# EAGLE design arduino_shield_schematic (EAGLE 9.6.2)
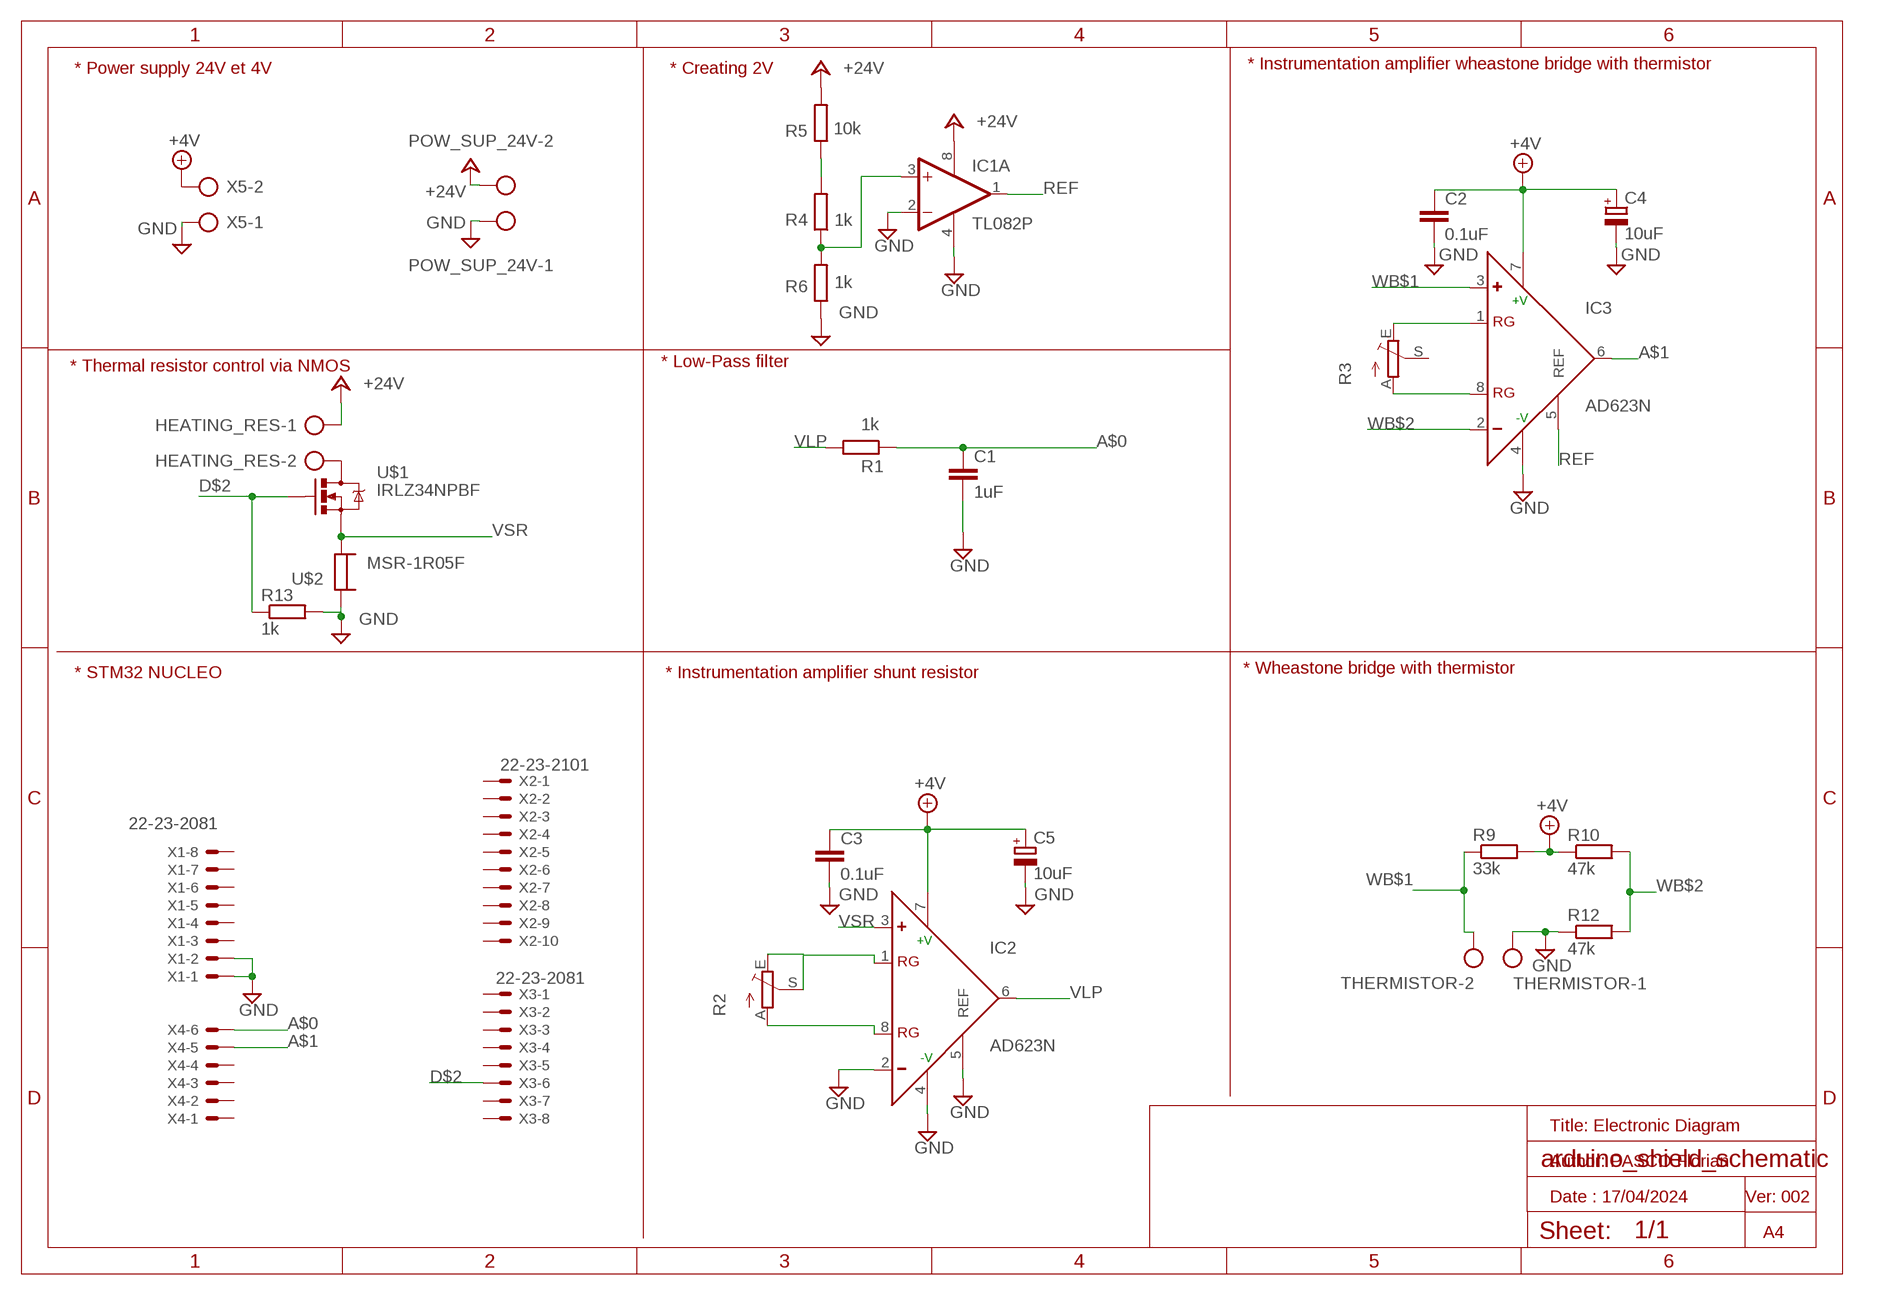
[diagram p0: schematic, sheet 1]

## Parts
C1  1uF  C-EU025-025X050  [C025-025X050]
C2  0.1uF  C-EU025-025X050  [C025-025X050]
C3  0.1uF  C-EU025-025X050  [C025-025X050]
C4  10uF  CPOL-EUE2,5-6E  [E2,5-6E]
C5  10uF  CPOL-EUE2,5-6E  [E2,5-6E]
HEATING_RES  AK300/2  [AK300/2]
IC1  TL082P  [DIL08]
IC2  AD623N  [DIL08]
IC3  AD623N  [DIL08]
POW_SUP_24V  AK300/2  [AK300/2]
R1  1k  R-EU_0207/10  [0207/10]
R2  TRIM_EU-S64W  [S64W]
R3  TRIM_EU-S64W  [S64W]
R4  1k  R-EU_0207/10  [0207/10]
R5  10k  R-EU_0207/10  [0207/10]
R6  1k  R-EU_0207/10  [0207/10]
R9  33k  R-EU_0207/10  [0207/10]
R10  47k  R-EU_0207/10  [0207/10]
R12  47k  R-EU_0207/10  [0207/10]
R13  1k  R-EU_0207/10  [0207/10]
THERMISTOR  AK300/2  [AK300/2]
U$1  IRLZ34NPBF  [TO-220(2)]
U$2  MSR-1R05F  [MSR1]
X1  22-23-2081  [22-23-2081]
X2  22-23-2101  [22-23-2101]
X3  22-23-2081  [22-23-2081]
X4  22-23-2061  [22-23-2061]
X5  AK300/2  [AK300/2]

## Nets
+4.1V: C2.1 C3.1 C4.+ C5.+ IC2.7(+V) IC3.7(+V) R9.2 R10.1 X5.2 ; supply symbol labelled +4V
+24V: HEATING_RES.1 IC1.8(P:V+) POW_SUP_24V.2 R5.2
A$0: C1.1 R1.1 X4.6
A$1: IC3.6(OUT) X4.5
D$2: R13.1 U$1.IN(G) X3.6
GND: C1.2 C2.2 C3.2 C4.- C5.- IC1.2(A:-IN) IC1.4(P:V-) IC2.2(-) IC2.4(-V) IC2.5(REF) IC3.4(-V) POW_SUP_24V.1 R6.1 R12.1 R13.2 THERMISTOR.1 U$2.P$2 X1.1 X1.2 X5.1
N$1: R2.E R2.S
N$2: IC2.1(RG)
N$3: R4.2 R5.1
N$4: IC1.3(A:+IN) R4.1 R6.2
N$5: IC2.8(RG) R2.A
N$6: IC3.1(RG) R3.E
N$7: IC3.8(RG) R3.A
N$10: HEATING_RES.2 U$1.GND(D)
REF: IC1.1(A:OUT) IC3.5(REF)
VLP: IC2.6(OUT) R1.2
VSR: IC2.3(+) U$1.OUT(S) U$2.P$1
WB$1: IC3.3(+) R9.1 THERMISTOR.2
WB$2: IC3.2(-) R10.2 R12.2
Unconnected: IC1.5(B:+IN) IC1.6(B:-IN) IC1.7(B:OUT) R3.S X1.3 X1.4 X1.5 X1.6 X1.7 X1.8 X2.1 X2.2 X2.3 X2.4 X2.5 X2.6 X2.7 X2.8 X2.9 X2.10 X3.1 X3.2 X3.3 X3.4 X3.5 X3.7 X3.8 X4.1 X4.2 X4.3 X4.4

## Notes on the sheet
- * Power supply 24V et 4V | * Creating 2V | * Instrumentation amplifier wheastone bridge with thermistor
- * Thermal resistor control via NMOS | * Low-Pass filter
- * STM32 NUCLEO | * Instrumentation amplifier shunt resistor | * Wheastone bridge with thermistor
- Title: Electronic Diagram
- Author: PASCO Florian
- Date : 17/04/2024 | Ver: 002
- A4

## Library data of the parts
C1-C3 = rcl:C-EU: CAPACITOR, European symbol; SPICEPREFIX: C
C4 C5 = rcl:CPOL-EU: POLARIZED CAPACITOR, European symbol; SPICEPREFIX: C
HEATING_RES POW_SUP_24V THERMISTOR X5 = con-ptr500:AK300/2: CONNECTOR; OC_FARNELL: unknown; OC_NEWARK: unknown
IC1 = linear:TL082: OP AMP Data sheet <http://www.ti.com/lit/ds/symlink/tl084a . pdf>; DATA_SHEET: <a href="http://www.ti.com/lit/ds/symlink/tl084a.pdf"> Data sheet </a>
IC2 IC3 = analog-devices:AD623: Single-Supply, Rail-to-Rail, Low Cost Instrumentation Amplifier Source: http://www.analog.com/static/imported-files/data_sheets/AD623.pdf; MF: ALTERA CORPORATION; MPN: AD623ANZ; OC_FARNELL: 9603700; OC_NEWARK: 59K4402
R1 R4-R6 R9 R10 R12 R13 = rcl:R-EU_: RESISTOR, European symbol; SPICEPREFIX: R
R2 R3 = pot:TRIM_EU-: POTENTIOMETER
U$1 = IRLZ34NPBF:IRLZ34NPBF: Check availability <https://pricing.snapeda.com/parts/IRLZ34NPBF/Infineon/view-part?ref=eda>; AVAILABILITY: In Stock; CHECK_PRICES: https://www.snapeda.com/parts/IRLZ34NPBF/Infineon+Technologies/view-part/?ref=eda; DESCRIPTION: MOSFET, Power,N-Ch,VDSS 55V,RDS(ON) 0.035Ohm,ID 30A,TO-220AB,PD 68W,VGS +/-16V | Infineon IRLZ34NPBF; MF: Infineon; MP: IRLZ34NPBF; PACKAGE: TO-220 Infineon; PRICE: None; PURCHASE-URL: https://www.snapeda.com/api/url_track_click_mouser/?unipart_id=219&manufacturer=Infineon&part_name=IRLZ34NPBF&search_term=None; SNAPEDA_LINK: https://www.snapeda.com/parts/IRLZ34NPBF/Infineon+Technologies/view-part/?ref=snap
U$2 = MSR-1R05F:MSR-1R05F
X1 X3 = con-molex:22-23-2081: .100" (2.54mm) Center Header - 8 Pin; MF: MOLEX; MPN: 22-23-2081; OC_FARNELL: 1756826; OC_NEWARK: 01C7592
X2 = con-molex:22-23-2101: .100" (2.54mm) Center Header - 10 Pin; MF: MOLEX; MPN: 22-23-2101; OC_FARNELL: 1756828; OC_NEWARK: 94C0765
X4 = con-molex:22-23-2061: .100" (2.54mm) Center Header - 6 Pin; MF: MOLEX; MPN: 22-23-2061; OC_FARNELL: 1462922; OC_NEWARK: 27C1933

## Board
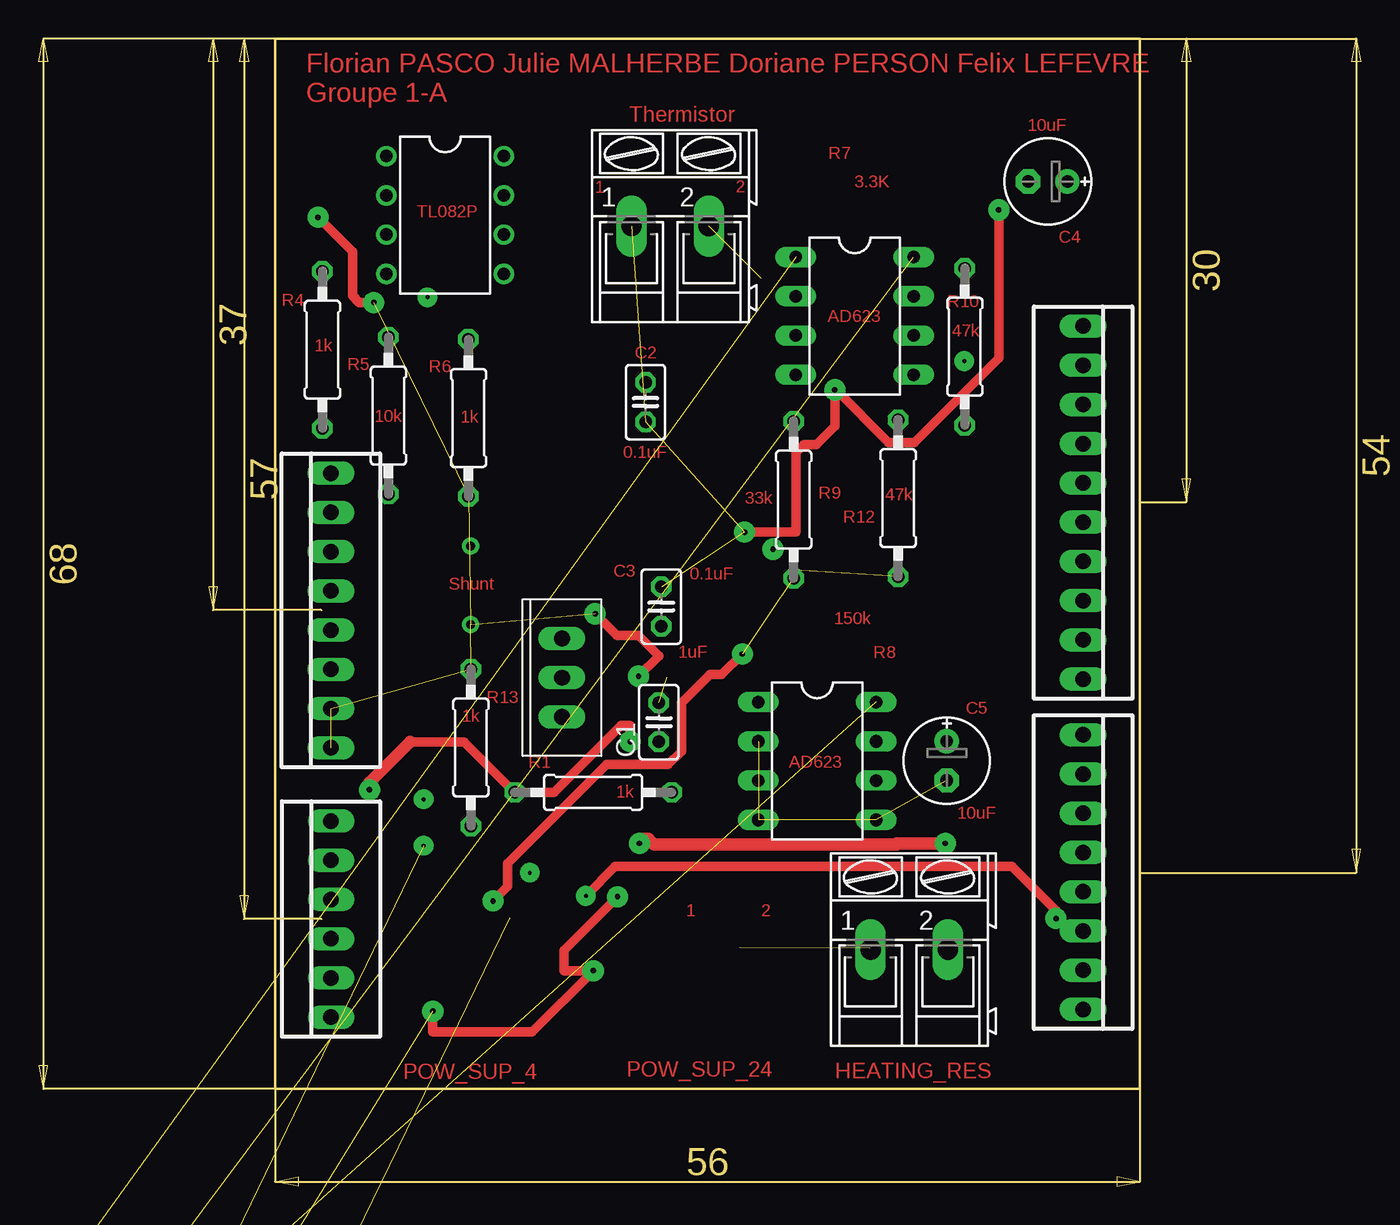
[diagram p1: board, top side]
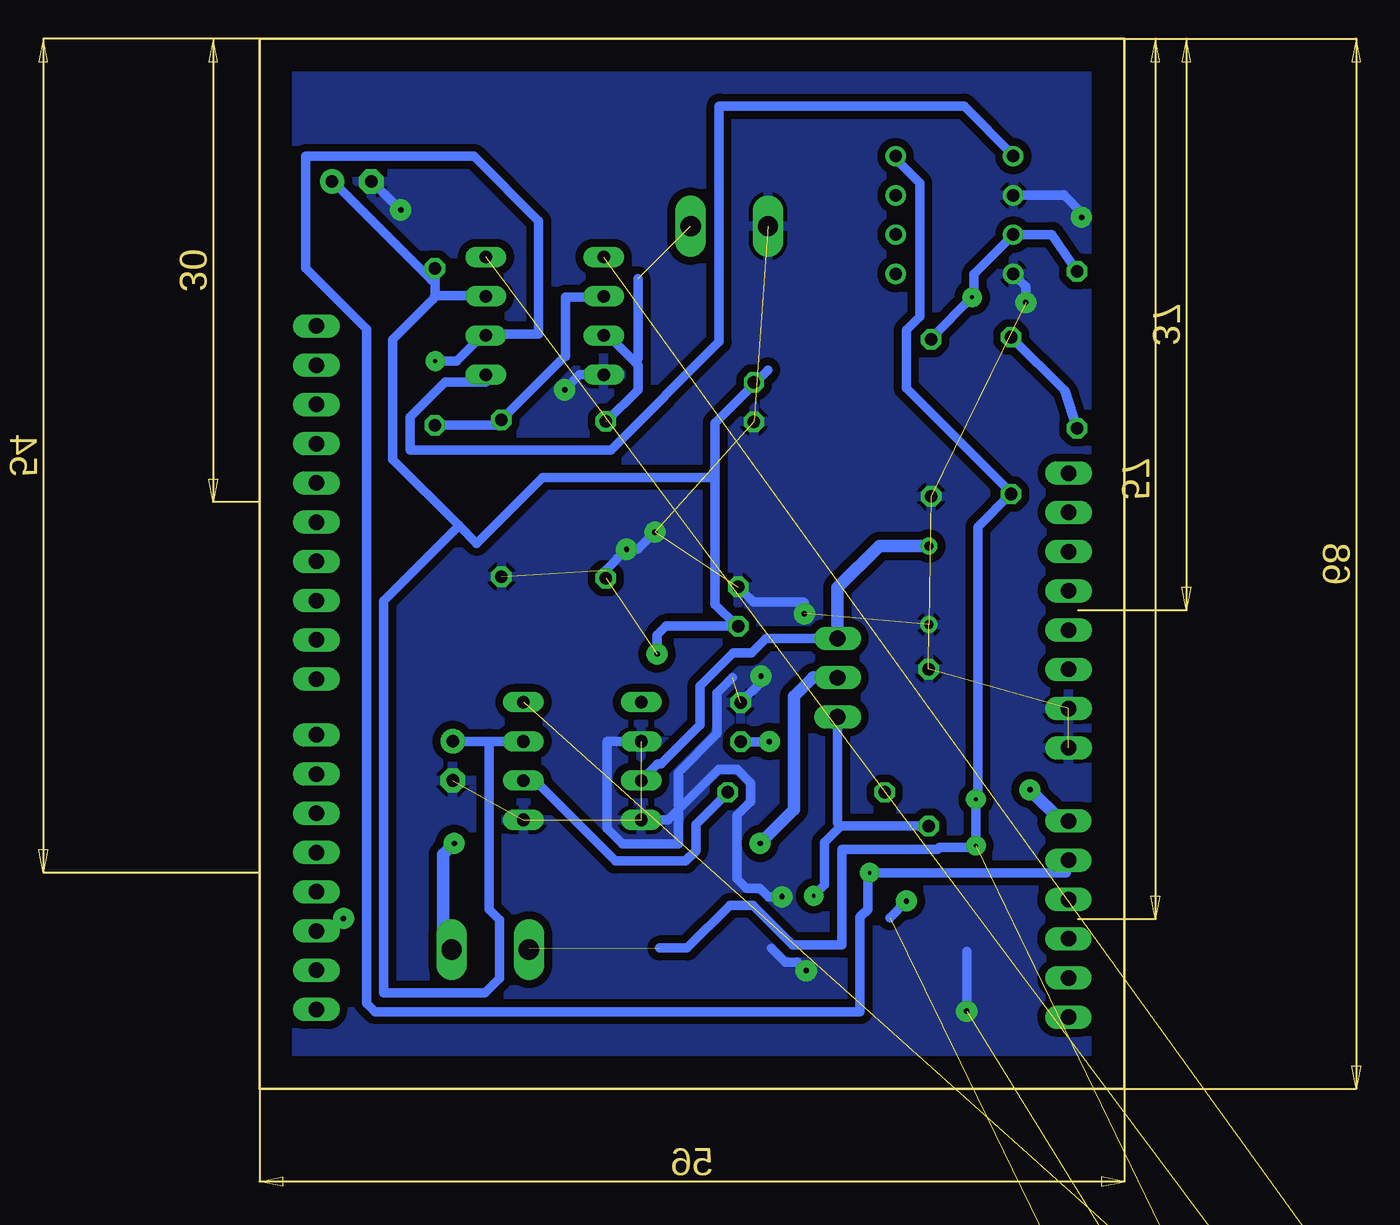
[diagram p2: board, bottom side, seen from below]

Size 56 x 68 mm. Coordinates in mm from the lower left corner, seen from the top.
Outline: 0,0 0,68 56,68 56,0 0,0
Copper layers (1*16): Top 0.035mm / dielectric 1.5mm / Bottom 0.035mm
Design rules "LBMS-ENIB": minimum track width 24mil, minimum drill 10mil, track to track 20mil, track to pad 20mil, pad to pad 20mil, via to via 20mil, smd to smd 8mil, copper to edge 80mil, drill to drill 8mil, minimum pad ring 10mil, minimum via ring 20mil, stop-mask expansion 4mil, vias tented up to drill 0mil, thermal gap 10mil

### Footprints (pad centres in the part's own frame; a part is rotated, then mirrored left to right if it is on the bottom)
C025-025X050 = drill 0.813 octagon: 1 -1.27,0; 2 1.27,0
E2,5-6E = drill 0.813 pad 1.575: + -1.27,0 | drill 0.813 pad 1.575 octagon: - 1.27,0
AK300/2 = drill 1.321 long: 1 -2.515,0; 2 2.489,0
DIL08 = drill 0.813 pad 1.27: 1 -3.81,-3.81; 2 -1.27,-3.81; 3 1.27,-3.81; 4 3.81,-3.81; 5 3.81,3.81; 6 1.27,3.81; 7 -1.27,3.81; 8 -3.81,3.81
DIL08' = drill 0.813 long: 1 -3.81,-3.81; 2 -1.27,-3.81; 3 1.27,-3.81; 4 3.81,-3.81; 5 3.81,3.81; 6 1.27,3.81; 7 -1.27,3.81; 8 -3.81,3.81
0207/10 = drill 0.813 octagon: 1 -5.08,0; 2 5.08,0
S64W = drill 0.813 long: A 2.54,1.27; E -2.54,1.27; S 0,1.27
TO-220(2) = drill 1.016 long: GND 0,0; IN -2.54,0; OUT 2.54,0
MSR1 = drill 0.6: P$1 -2.54,0; P$2 2.54,0
22-23-2081 = drill 1 long: 1 -8.89,0; 2 -6.35,0; 3 -3.81,0; 4 -1.27,0; 5 1.27,0; 6 3.81,0; 7 6.35,0; 8 8.89,0
22-23-2101 = drill 1 long: 1 -11.43,0; 2 -8.89,0; 3 -6.35,0; 4 -3.81,0; 5 -1.27,0; 6 1.27,0; 7 3.81,0; 8 6.35,0; 9 8.89,0; 10 11.43,0
22-23-2061 = drill 1 long: 1 -6.35,0; 2 -3.81,0; 3 -1.27,0; 4 1.27,0; 5 3.81,0; 6 6.35,0

### Placement (x,y rotation side)
C1  24.85,23.74 90 top
C2  23.99,44.46 270 top
C3  25.01,31.23 90 top
C4  50.03,58.75 180 top
C5  43.49,21.24 270 top
HEATING_RES  41.08,9.03 0 top
IC1  11.01,56.58 270 top
IC2  AD623N  [DIL08']  35.1,21.23 270 top
IC3  AD623N  [DIL08']  37.53,50.05 270 top
POW_SUP_24V  -37.24,-76.01 0 top  (outside the outline)
R1  20.6,19.2 0 top
R2  -37.58,-42.45 0 top  (outside the outline)
R3  -37.58,-49.77 0 top  (outside the outline)
R4  3.08,47.86 270 top
R5  7.34,43.59 270 top
R6  12.53,43.44 90 top
R9  33.58,38.15 270 top
R10  44.66,48.05 270 top
R12  40.34,38.25 90 top
R13  12.68,22.1 90 top
THERMISTOR  25.6,55.86 0 top
U$1  18.58,26.63 90 top
U$2  12.66,32.61 270 top
X1  3.62,30.98 90 top
X2  52.32,37.96 270 top
X3  52.32,14.04 270 top
X4  3.63,11 90 top
X5  -37.24,-91.61 0 top  (outside the outline)

### Tracks (layer width: path | path; a pad name or v marks a point on that pad's centre or on a via)
+4.1V  (via drill 0.35)  (2 unrouted)
  Top 0.61: v30.26,28.16 28.92,26.82 28.15,26.82 26.32,25 26.32,21.86 25.46,21 21.45,21 15.05,14.6 15.05,13.4 15.05,13.1 v14.12,12.17
  Bottom 0.61: 44.62,51.38 41.38,51.38 IC3.7 | 44.62,52.38 44.62,53.12 R10.1 | 44.62,52.38 44.62,51.38 | C4.+ 51.25,58.75 44.88,52.38 44.62,52.38 | 41.12,22.5 43.38,22.5 C5.+ | 41.12,22.5 IC2.7 | 26.5,39.58 26.5,43.12 24.12,45.5 | 26.5,39.58 26.5,31.38 25.12,30 C3.1 29.68,29.96 30.26,29.38 v30.26,28.16 | 24.12,45.5 C2.1 | 41.12,22.5 41.12,11.62 40.45,10.95 40.45,7.17 41.4,6.22 47.95,6.22 47.95,31.6 43.09,36.46 | 26.5,39.58 37.67,39.58 41.94,35.31 43.09,36.46 | 43.09,36.46 47.38,40.75 47.38,48.5 44.75,51.12 44.62,51.38 | 23.09,46.54 24.12,45.5 | v14.12,12.17 15.2,11.09
+24V  (via drill 0.25)  (2 unrouted)
  Bottom 0.61: IC1.8 14.75,60.12 13.25,58.62 13.25,50 14.12,49.12 14.12,45.38 7.5,38.75 R5.2 7.38,38.5 9.5,36.38 9.5,19 v9.62,18.75 v9.62,15.75 9.88,15.62 12,15.62 12.12,15.5 18.31,15.5 18.31,9.32 21.5,9.32 24.06,11.88 25.56,11.88 28.31,9.12 30.1,9.12
  Bottom 0.813: 38.51,9.09 HEATING_RES.1
A$0  (via drill 0.35)
  Top 0.61: 8.75,22.47 12.25,22.47 R1.1 18.07,19.2 22.41,23.54 22.98,23.54 23,23.52 v23,22.49
  Top 0.813: 8.75,22.47 6.12,19.84 v6.12,19.37
  Bottom 0.61: v23,22.49 23.02,22.47 C1.1
  Bottom 0.813: v6.12,19.37 4.1,17.35 X4.6
A$1  (via drill 0.25)
  Bottom 0.61: v44.62,47.12 43.25,47.12 41.62,48.75 41.38,48.75 IC3.6 41.12,48.88 37.92,48.88 37.92,56.17 42.12,60.38 53,60.38 53,53.12 49.07,49.2 49.07,5.55 48.52,5 17.11,5 17.11,11.15 16.62,11.64 16.62,13.75 v16.5,14 3.75,14 3.75,14.75 X4.5
D$2  (via drill 0.25, 0.35)
  Top 0.61: v20.12,12.5 22.02,14.4 47.72,14.4 50.57,11.56 v50.57,11.04
  Bottom 0.61: v50.57,11.04 51.37,10.23 X3.6 | v20.12,12.5 19.43,13.2 19.43,15.96 18.37,17.02 | 18.37,17.02 R13.1 | U$1.IN 18.58,17.24 18.37,17.02
GND  (via drill 0.35)  (16 unrouted)
  Top 0.61: v20.73,30.77 22.15,29.35 23.54,29.35 24.85,28.04 v23.54,26.72 | v30.4,36.05 33.72,36.05 33.72,41.21 34.23,41.72 35.05,41.72 36.24,42.91 v36.24,45.27 36.32,45.27 39.73,41.86 41.4,41.86 46.86,47.31 v46.86,56.91 | v22.18,12.44 18.71,8.97 18.71,7.65 v20.61,7.65 16.65,3.69 10.22,3.69 v10.22,5.03 | v2.79,56.44 5.02,54.21 5.02,51.35 5.45,50.92 v6.39,50.92
  Bottom 0.61: IC2.2 33.5,22.5 33.5,16.88 32.5,15.88 28.88,15.88 28.88,20.5 26.38,23 26.38,25.62 25.38,26.62 | v36.24,45.27 35.27,46.24 IC3.4 | v46.86,56.91 48.7,58.75 C4.- | 33.58,33.6 v32.24,34.94 31.51,34.94 v30.4,36.05 | C3.2 24.02,31.51 20.77,31.51 20.73,31.47 v20.73,30.77 | v23.54,26.72 23.54,26.32 C1.2 | IC2.4 29.54,17.42 26.29,20.67 25.07,20.67 24.21,19.81 24.21,18.59 25.08,17.71 25.08,13.6 24.48,13 23.6,13 23.04,12.44 v22.18,12.44 | v20.61,7.65 21.16,8.2 21.96,8.2 22.85,9.09 | IC1.2 3.98,57.85 3.94,57.89 2.79,56.74 v2.79,56.44 | v6.39,50.92 6.39,51.96 IC1.4 | v10.22,5.03 10.22,8.91
  pour Bottom: 20.3,96.05 0.97,96.05 -42.52,52.56 -42.52,3.33 -3.11,-36.08 95.3,-36.08 98.17,-33.21 98.17,74.54 86.94,85.77 76.63,96.08 20.05,96.08
N$1  (1 unrouted)
N$3
  Bottom 0.61: R5.1 3.87,45.21 R4.2
N$4  (via drill 0.25)
  Bottom 0.61: R6.2 12.5,48.62 v9.88,51.25 9.75,51.5 9.75,52.75 7.25,55.25 IC1.3 4.69,55.31 R4.1
N$5  (1 unrouted)
N$6  (1 unrouted)
N$7  (1 unrouted)
N$10  (via drill 0.35)
  Top 0.813: v43.4,15.9 40.27,15.9 40.22,15.85 24.55,15.85 24.2,16.2 23.89,16.2 v23.59,15.9
  Bottom 0.813: HEATING_RES.2 44.1,9.56 44.1,15.2 v43.4,15.9 | v23.59,15.9 21.4,18.08 21.4,25.41 20.18,26.63 U$1.GND
REF
  Bottom 0.61: IC1.1 7.25,60.5 10.38,63.62 26.25,63.62 26.25,48.38 33.25,41.38 46.25,41.38 46.25,43.5 44,45.75 41.38,45.75 41.38,46.12 IC3.5
VLP
  Bottom 0.61: IC2.6 38.17,19.96 32.96,14.76 28.41,14.76 27.76,15.41 27.76,17.12 R1.2
VSR
  Bottom 0.61: IC2.3 30.22,21.03 30.02,21.03 27.49,23.55 27.49,26.09 25.36,28.22 24.16,28.22 23.2,29.17 U$1.OUT
  Bottom 0.813: U$2.P$1 15.88,35.15 18.58,32.45 U$1.OUT
WB$1  (2 unrouted)
  Bottom 0.61: 31.69,47.06 33.38,48.75 33.62,48.75 IC3.3 | 31.69,47.06 31.5,46.88 31.5,45.25 33.52,43.23 | 31.69,47.06 31.5,47.25 31.5,52.45
WB$2
  Bottom 0.61: IC3.2 33.75,51.25 36.2,51.25 36.2,47.42 36.24,47.42 R12.2 40.7,42.97 R10.2

### Text on the board
Top: Florian PASCO Julie MALHERBE Doriane PERSON Felix LEFEVRE | Groupe 1-A | Thermistor | 10uF | R7 | 1 | 2 | 3.3K | TL082P | C4 | R4 | R10 | AD623 | 47k | 1k | R5 | C2 | R6 | 10k | 1k | 0.1uF | 33k | R9 | 47k | R12 | C3 | 0.1uF | Shunt | 150k | 1uF | R8 | R13 | 1k | C5 | R1 | AD623 | 1k | 10uF | 1 | 2 | POW_SUP_4 | POW_SUP_24 | HEATING_RES